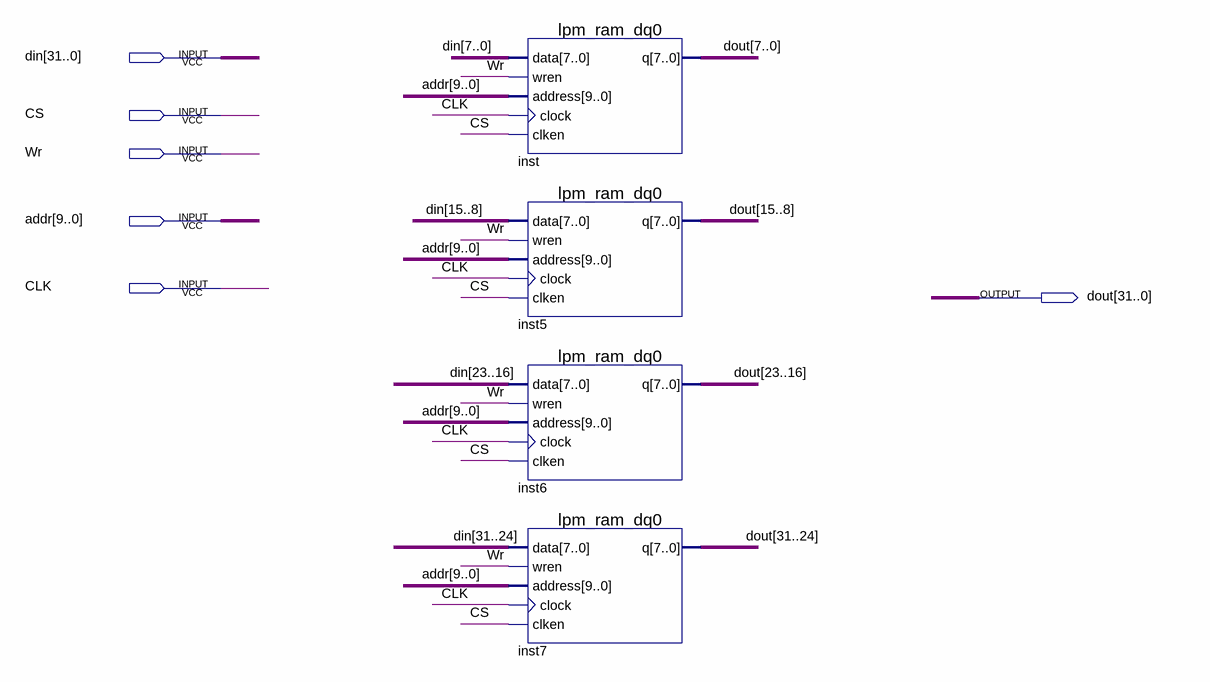
[diagram p0: schematic sheet]
// Quartus schematic DMEM.bdf as structural Verilog: 4 symbols, 6 pins
module DMEM (
  input  [31:0] din,
  input  CS,
  input  Wr,
  input  [9:0] addr,
  input  CLK,
  output [31:0] dout
);

  lpm_ram_dq0 inst (.data(din[7:0]), .wren(Wr), .address(addr), .clock(CLK), .clken(CS), .q(dout[7:0]));
  lpm_ram_dq0 inst5 (.data(din[15:8]), .wren(Wr), .address(addr), .clock(CLK), .clken(CS), .q(dout[15:8]));
  lpm_ram_dq0 inst6 (.data(din[23:16]), .wren(Wr), .address(addr), .clock(CLK), .clken(CS), .q(dout[23:16]));
  lpm_ram_dq0 inst7 (.data(din[31:24]), .wren(Wr), .address(addr), .clock(CLK), .clken(CS), .q(dout[31:24]));
endmodule
